# Altium schematic sheet CON_DEBUG_10WBOXHDRRAM.SchDoc: 8-Way Debug Header
size A4; Organization: Altium Limited.; Address1: Level 3, 12a Rodborough Rd; Address2: Frenchs Forest 2086; Address3: NSW; Address4: AUSTRALIA; Revision: 6; SheetNumber: 43; SheetTotal: 64
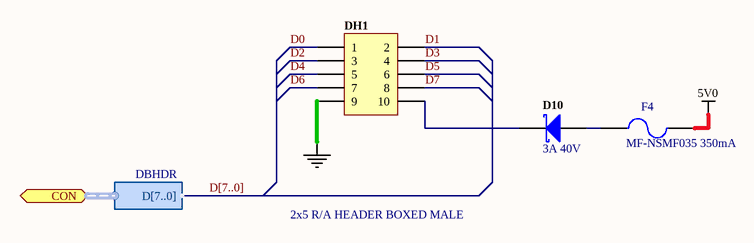
[diagram p0: CON_DEBUG_10WBOXHDRRAM.SchDoc]

## Parts
D10  3A 40V  [DIOM5027]
DH1  2x5 R/A HEADER BOXED MALE  [918510x323]
F4  MF-NSMF035 350mA  [RESC3216]

## Ports
CON (harness DBHDR)

## Harnesses
DBHDR: D[7..0]

## Nets
5V0: F4.2
GND: DH1.9
D0: DH1.1
D1: DH1.2
D2: DH1.3
D3: DH1.4
D4: DH1.5
D5: DH1.6
D6: DH1.7
D7: DH1.8
NetD10_1: D10.1(A) F4.1
NetD10_2: D10.2(K) DH1.10

## Buses and harness runs
bus D[7..0]

## Notes on the sheet
- Sheet Title
- Project Title
- Size:
- Date:
- A4
- Assy:
- Time:
- Sheet
- Revision:
- of
- File:

## Library data of the parts
D10 = D-151-0000: Schottky Diode, 3A 40V; Category: Diode-Schottky; Status: Production
DH1 = D-300-0014: Header IDC, 2 x 5 Pin Right-Angle 2.54mm Pitch (Boxed-Male); Max Current: 3 A; Category: Connector; Connector type: Header; Mounting Technology: Through-Hole; Pin Count: 10; Status: Production
F4 = D-106-0001: Multifuse, SMD 1206, 350mA; Rated Voltage: 6 V; Amperage: 350 mA; Category: Fuse